# Altium project DIOT_Sampler.PrjPCB (part 1 of 5)
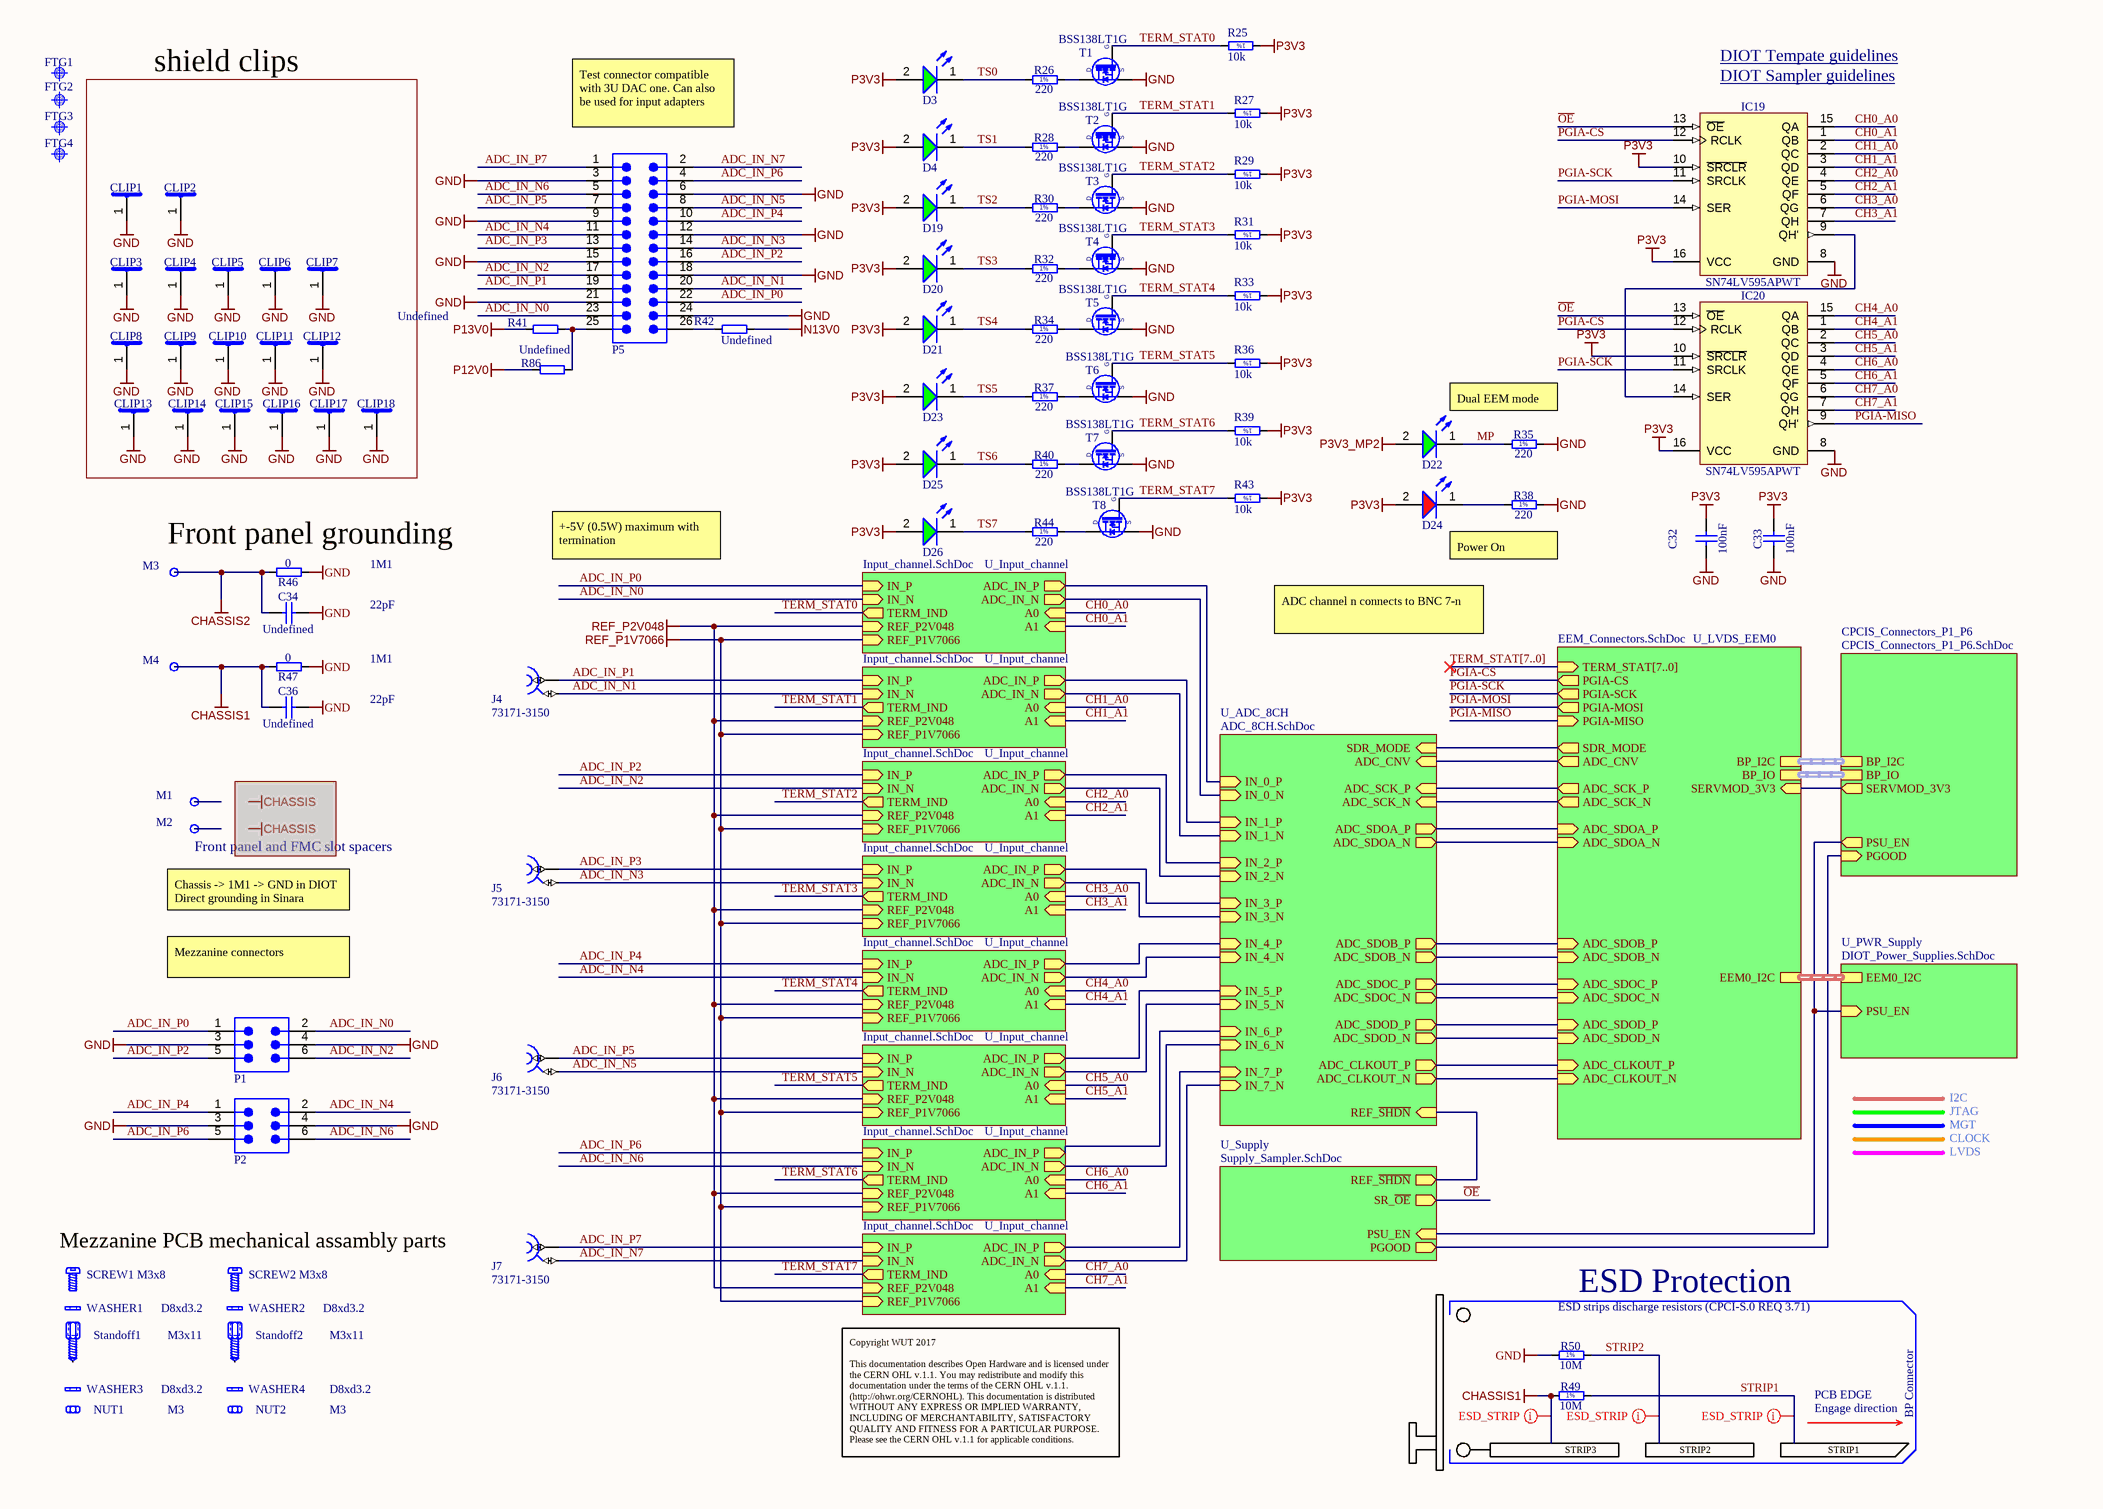
[diagram p0: Sampler.schdoc]
7 sheets, 679 parts. Net scope: hierarchical (ports join the sheet entries above them; power ports are global).
Board file: DIOT_Sampler.PCBDOC
Sheets:
  Sampler.schdoc
    U_ADC_8CH = ADC_8CH.SchDoc
    U_LVDS_EEM0 = EEM_Connectors.SchDoc
    U_Supply = Supply_Sampler.SchDoc
    U_Input_channel = Input_channel.SchDoc
    U_Input_channel = Input_channel.SchDoc
    U_Input_channel = Input_channel.SchDoc
    U_Input_channel = Input_channel.SchDoc
    U_Input_channel = Input_channel.SchDoc
    U_Input_channel = Input_channel.SchDoc
    U_Input_channel = Input_channel.SchDoc
    U_Input_channel = Input_channel.SchDoc
    U_PWR_Supply = DIOT_Power_Supplies.SchDoc
    CPCIS_Connectors_P1_P6 = CPCIS_Connectors_P1_P6.SchDoc

## Sheet Sampler.schdoc: Sampler - top
size A3; Author: G.K.; CompanyName: WUT; DrawnBy: G.K.; Organization: CERN; Address1: Warsaw Univeristy of Technology; Address2: Nowowiejska 15/19; DocumentNumber: 1; Revision: -; SheetNumber: 1; SheetTotal: 5; EDA_Number: ARTIQ; Projet: Sampler; ModifiedBy: -; CreateDate: XX/XX/XXXX; CheckedDate: -; Title2: 8 channel ADC v2.3.1; DivGrp: ISE; Designer: G.K.; SPICEModelCacheCKYBAJTW: <root> / <DocumentId>CKYBAJTW</DocumentId> / <CacheFrame Number="0"> / <Model Name="0603_155060gs75300" Kind="CKT"> / <Text>******** / .subckt 0603_155060GS75300 1 2 / D1 1 2 SMSW / .MODEL SMSW D / + IS=695.94E-6 / + N=5 / + RS=2.4677 / + IKF=16.109E-12 / + CJO=1.0000E-12 / + M=.3333 / + VJ=.75 / + BV=5 / + IBV=10.00E-6 / + TT=5.0000E-9 / .ends</Text> / </Model> / <Model Name="0603_155060rs75300" Kind="CKT"> / <Text>******** / .subckt 0603_155060RS75300 1 2 / D1 1 2 SMSW / .MODEL SMSW D / + IS=824.78E-18 / + N=2.2038 / + RS=.38595 / + IKF=240.07E-6 / + CJO=1.0000E-12 / + M=.3333 / + VJ=.75 / + BV=5 / + IBV=10.00E-6 / + TT=5.0000E-9 / .ends</Text> / </Model> / </CacheFrame> / </root>; ModifiedDate: -; ProjectName: Sampler

### Parts
(Parts that share a designator on the sheet are numbered #1, #2 ... from top to bottom, then left to right.)
C32  100nF  [CAPC1608X87N]
C33  100nF  [CAPC1608X87N]
C34  Undefined  [CAPC2012X135N]
C36  Undefined  [CAPC2012X135N]
CLIP1  S1411-46R  [CLIP_HOLLAND-SHIELDING_LC]  (value not drawn)
CLIP2  S1411-46R  [CLIP_HOLLAND-SHIELDING_LC]  (value not drawn)
CLIP3  S1411-46R  [CLIP_HOLLAND-SHIELDING_LC]  (value not drawn)
CLIP4  S1411-46R  [CLIP_HOLLAND-SHIELDING_LC]  (value not drawn)
CLIP5  S1411-46R  [CLIP_HOLLAND-SHIELDING_LC]  (value not drawn)
CLIP6  S1411-46R  [CLIP_HOLLAND-SHIELDING_LC]  (value not drawn)
CLIP7  S1411-46R  [CLIP_HOLLAND-SHIELDING_LC]  (value not drawn)
CLIP8  S1411-46R  [CLIP_HOLLAND-SHIELDING_LC]  (value not drawn)
CLIP9  S1411-46R  [CLIP_HOLLAND-SHIELDING_LC]  (value not drawn)
CLIP10  S1411-46R  [CLIP_HOLLAND-SHIELDING_LC]  (value not drawn)
CLIP11  S1411-46R  [CLIP_HOLLAND-SHIELDING_LC]  (value not drawn)
CLIP12  S1411-46R  [CLIP_HOLLAND-SHIELDING_LC]  (value not drawn)
CLIP13  S1411-46R  [CLIP_HOLLAND-SHIELDING_LC]  (value not drawn)
CLIP14  S1411-46R  [CLIP_HOLLAND-SHIELDING_LC]  (value not drawn)
CLIP15  S1411-46R  [CLIP_HOLLAND-SHIELDING_LC]  (value not drawn)
CLIP16  S1411-46R  [CLIP_HOLLAND-SHIELDING_LC]  (value not drawn)
CLIP17  S1411-46R  [CLIP_HOLLAND-SHIELDING_LC]  (value not drawn)
CLIP18  S1411-46R  [CLIP_HOLLAND-SHIELDING_LC]  (value not drawn)
D3  Green, 3.2V, 140°  [WL-SMSW_0603_L1.6W0.98H0.8]  (value not drawn)
D4  Green, 3.2V, 140°  [WL-SMSW_0603_L1.6W0.98H0.8]  (value not drawn)
D19  Green, 3.2V, 140°  [WL-SMSW_0603_L1.6W0.98H0.8]  (value not drawn)
D20  Green, 3.2V, 140°  [WL-SMSW_0603_L1.6W0.98H0.8]  (value not drawn)
D21  Green, 3.2V, 140°  [WL-SMSW_0603_L1.6W0.98H0.8]  (value not drawn)
D22  Green, 3.2V, 140°  [WL-SMSW_0603_L1.6W0.98H0.8]  (value not drawn)
D23  Green, 3.2V, 140°  [WL-SMSW_0603_L1.6W0.98H0.8]  (value not drawn)
D24  Red, 2V, 140°  [WL-SMSW_0603_L1.6W0.98H0.8]  (value not drawn)
D25  Green, 3.2V, 140°  [WL-SMSW_0603_L1.6W0.98H0.8]  (value not drawn)
D26  Green, 3.2V, 140°  [WL-SMSW_0603_L1.6W0.98H0.8]  (value not drawn)
FTG1  Use only in PCB  [FIDUCIAL_TOP_C100-200]  (value not drawn)  (no BOM)
FTG2  Use only in PCB  [FIDUCIAL_TOP_C100-200]  (value not drawn)  (no BOM)
FTG3  Use only in PCB  [FIDUCIAL_TOP_S100-200]  (value not drawn)  (no BOM)
FTG4  Use only in PCB  [FIDUCIAL_TOP_S100-200]  (value not drawn)  (no BOM)
IC19  SN74LV595APWT  [SOP65P640X120-16N]
IC20  SN74LV595APWT  [SOP65P640X120-16N]
J4  73171-3150  [MOLEX_73171-3150]
J5  73171-3150  [MOLEX_73171-3150]
J6  73171-3150  [MOLEX_73171-3150]
J7  73171-3150  [MOLEX_73171-3150]
M1  Plated Hole  [MTG300_600]  (value not drawn)  (no BOM)
M2  Plated Hole  [MTG300_600]  (value not drawn)  (no BOM)
M3  Plated Hole  [MTG300_600]  (value not drawn)  (no BOM)
M4  Plated Hole  [MTG300_600]  (value not drawn)  (no BOM)
NUT1  M3  [BOSSARD_BN81-1400401_v]
NUT2  M3  [BOSSARD_BN81-1400401_v]
P1  61300621121  [61300621121]  (value not drawn)
P2  61300621121  [61300621121]  (value not drawn)
P5  61302621121  [61302621121]  (value not drawn)
R25  10k  [RESC1005X40N]
R26  220  [RESC1608X55N]
R27  10k  [RESC1005X40N]
R28  220  [RESC1608X55N]
R29  10k  [RESC1005X40N]
R30  220  [RESC1608X55N]
R31  10k  [RESC1005X40N]
R32  220  [RESC1608X55N]
R33  10k  [RESC1005X40N]
R34  220  [RESC1608X55N]
R35  220  [RESC1608X55N]
R36  10k  [RESC1005X40N]
R37  220  [RESC1608X55N]
R38  220  [RESC1608X55N]
R39  10k  [RESC1005X40N]
R40  220  [RESC1608X55N]
R41  Undefined  [RESC1608X55N]
R42  Undefined  [RESC1608X55N]
R43  10k  [RESC1005X40N]
R44  220  [RESC1608X55N]
R46  0  [RESC1608X55N]
R47  0  [RESC1608X55N]
R49  10M  [RESC2113X55N]
R50  10M  [RESC2113X55N]
R86#1  Undefined  [RESC1608X55N]
SCREW1  M3x8  [BOSSARD_BN5687-3061606_v]
SCREW2  M3x8  [BOSSARD_BN5687-3061606_v]
Standoff1  M3x11  [SAMTEC_SO-1115-03-N]
Standoff2  M3x11  [SAMTEC_SO-1115-03-N]
T1  BSS138LT1G  [SOT95P240X110-3N]
T2  BSS138LT1G  [SOT95P240X110-3N]
T3  BSS138LT1G  [SOT95P240X110-3N]
T4  BSS138LT1G  [SOT95P240X110-3N]
T5  BSS138LT1G  [SOT95P240X110-3N]
T6  BSS138LT1G  [SOT95P240X110-3N]
T7  BSS138LT1G  [SOT95P240X110-3N]
T8  BSS138LT1G  [SOT95P240X110-3N]
WASHER1  D8xd3.2  [BOSSARD_BN678-1250191_v]
WASHER2  D8xd3.2  [BOSSARD_BN678-1250191_v]
WASHER3  D8xd3.2  [BOSSARD_BN678-1250191_v]
WASHER4  D8xd3.2  [BOSSARD_BN678-1250191_v]

### Blocks framed on the sheet
shield clips: CLIP1-CLIP18

### Sub-sheets
CPCIS_Connectors_P1_P6 = CPCIS_Connectors_P1_P6.SchDoc: BP_I2C (harness I2C), SERVMOD_3V3 (out), PSU_EN (out), BP_IO (harness EEM_LVDS), PGOOD (in)
U_ADC_8CH = ADC_8CH.SchDoc: IN_1_P (in), IN_2_P (in), IN_0_P (in), IN_3_P (in), IN_4_P (in), IN_5_P (in), IN_6_P (in), IN_7_P (in), IN_0_N (in), IN_1_N (in), IN_2_N (in), IN_3_N (in), IN_6_N (in), IN_7_N (in), IN_4_N (in), IN_5_N (in), ADC_SDOA_P (out), ADC_SDOA_N (out), ADC_SCK_P (in), ADC_SCK_N (in), ADC_CNV (in), ADC_SDOB_N (out), ADC_SDOB_P (out), ADC_SDOC_P (out), ADC_SDOC_N (out), ADC_SDOD_N (out), ADC_SDOD_P (out), ADC_CLKOUT_P (out), ADC_CLKOUT_N (out), SDR_MODE (in), REF_~{SHDN} (in)
U_Input_channel = Input_channel.SchDoc: IN_N (in), A0 (in), A1 (in), IN_P (in), TERM_IND (out), ADC_IN_N (out), ADC_IN_P (out), REF_P2V048 (in), REF_P1V7066 (in)
U_Input_channel = Input_channel.SchDoc: IN_N (in), A0 (in), A1 (in), IN_P (in), TERM_IND (out), ADC_IN_N (out), ADC_IN_P (out), REF_P2V048 (in), REF_P1V7066 (in)
U_Input_channel = Input_channel.SchDoc: IN_N (in), A0 (in), A1 (in), IN_P (in), TERM_IND (out), ADC_IN_N (out), ADC_IN_P (out), REF_P2V048 (in), REF_P1V7066 (in)
U_Input_channel = Input_channel.SchDoc: IN_N (in), A0 (in), A1 (in), IN_P (in), TERM_IND (out), ADC_IN_N (out), ADC_IN_P (out), REF_P2V048 (in), REF_P1V7066 (in)
U_Input_channel = Input_channel.SchDoc: IN_N (in), A0 (in), A1 (in), IN_P (in), TERM_IND (out), ADC_IN_N (out), ADC_IN_P (out), REF_P2V048 (in), REF_P1V7066 (in)
U_Input_channel = Input_channel.SchDoc: IN_N (in), A0 (in), A1 (in), IN_P (in), TERM_IND (out), ADC_IN_N (out), ADC_IN_P (out), REF_P2V048 (in), REF_P1V7066 (in)
U_Input_channel = Input_channel.SchDoc: IN_N (in), A0 (in), A1 (in), IN_P (in), TERM_IND (out), ADC_IN_N (out), ADC_IN_P (out), REF_P2V048 (in), REF_P1V7066 (in)
U_Input_channel = Input_channel.SchDoc: IN_N (in), A0 (in), A1 (in), IN_P (in), TERM_IND (out), ADC_IN_N (out), ADC_IN_P (out), REF_P2V048 (in), REF_P1V7066 (in)
U_LVDS_EEM0 = EEM_Connectors.SchDoc: TERM_STAT[7..0] (in), PGIA-CS (out), PGIA-SCK (out), PGIA-MOSI (out), PGIA-MISO (in), ADC_SDOA_N (in), ADC_SDOA_P (in), ADC_SCK_N (out), ADC_SCK_P (out), ADC_CNV (out), SDR_MODE (out), EEM0_I2C (harness I2C), BP_IO (harness EEM_LVDS), BP_I2C (harness I2C), SERVMOD_3V3 (in), ADC_SDOB_P (in), ADC_SDOB_N (in), ADC_SDOC_P (in), ADC_SDOC_N (in), ADC_SDOD_P (in), ADC_SDOD_N (in), ADC_CLKOUT_P (in), ADC_CLKOUT_N (in)
U_PWR_Supply = DIOT_Power_Supplies.SchDoc: EEM0_I2C (harness I2C), PSU_EN (in)
U_Supply = Supply_Sampler.SchDoc: REF_~{SHDN} (out), SR_~{OE} (out), PSU_EN (in), PGOOD (out)

### Nets
CHASSIS1: C36.1 M4.1 R47.2 R49.1
CHASSIS2: C34.1 M3.1 R46.2
GND: C32.1 C33.1 C34.2 C36.2 CLIP1.1 CLIP2.1 CLIP3.1 CLIP4.1 CLIP5.1 CLIP6.1 CLIP7.1 CLIP8.1 CLIP9.1 CLIP10.1 CLIP11.1 CLIP12.1 CLIP13.1 CLIP14.1 CLIP15.1 CLIP16.1 CLIP17.1 CLIP18.1 IC19.8(GND) IC20.8(GND) P1.3 P1.4 P2.3 P2.4 P5.3 P5.6 P5.9 P5.12 P5.15 P5.18 P5.21 P5.24 R35.2 R38.2 R46.1 R47.1 R50.1 T1.2(S) T2.2(S) T3.2(S) T4.2(S) T5.2(S) T6.2(S) T7.2(S) T8.2(S)
N13V0: R42.2
P3V3: C32.2 C33.2 D3.2(A) D4.2(A) D19.2(A) D20.2(A) D21.2(A) D23.2(A) D24.2(A) D25.2(A) D26.2(A) IC19.10(~{SRCLR}) IC19.16(VCC) IC20.10(~{SRCLR}) IC20.16(VCC) R25.1 R27.1 R29.1 R31.1 R33.1 R36.1 R39.1 R43.1
P3V3_MP2: D22.2(A)
P12V0: R86#1.2
P13V0: R41.2
REF_P1V7066: sheet U_Input_channel/REF_P1V7066, sheet U_Input_channel/REF_P1V7066, sheet U_Input_channel/REF_P1V7066, sheet U_Input_channel/REF_P1V7066, sheet U_Input_channel/REF_P1V7066, sheet U_Input_channel/REF_P1V7066, sheet U_Input_channel/REF_P1V7066, sheet U_Input_channel/REF_P1V7066
REF_P2V048: sheet U_Input_channel/REF_P2V048, sheet U_Input_channel/REF_P2V048, sheet U_Input_channel/REF_P2V048, sheet U_Input_channel/REF_P2V048, sheet U_Input_channel/REF_P2V048, sheet U_Input_channel/REF_P2V048, sheet U_Input_channel/REF_P2V048, sheet U_Input_channel/REF_P2V048
ADC_CLKOUT_N: sheet U_ADC_8CH/ADC_CLKOUT_N, sheet U_LVDS_EEM0/ADC_CLKOUT_N
ADC_CLKOUT_P: sheet U_ADC_8CH/ADC_CLKOUT_P, sheet U_LVDS_EEM0/ADC_CLKOUT_P
ADC_IN_N0: P1.2 P5.23 ; sheet U_Input_channel/IN_N
ADC_IN_N1: J4.2 P5.20 ; sheet U_Input_channel/IN_N
ADC_IN_N2: P1.6 P5.17 ; sheet U_Input_channel/IN_N
ADC_IN_N3: J5.2 P5.14 ; sheet U_Input_channel/IN_N
ADC_IN_N4: P2.2 P5.11 ; sheet U_Input_channel/IN_N
ADC_IN_N5: J6.2 P5.8 ; sheet U_Input_channel/IN_N
ADC_IN_N6: P2.6 P5.5 ; sheet U_Input_channel/IN_N
ADC_IN_N7: J7.2 P5.2 ; sheet U_Input_channel/IN_N
ADC_IN_P0: P1.1 P5.22 ; sheet U_Input_channel/IN_P
ADC_IN_P1: J4.1 P5.19 ; sheet U_Input_channel/IN_P
ADC_IN_P2: P1.5 P5.16 ; sheet U_Input_channel/IN_P
ADC_IN_P3: J5.1 P5.13 ; sheet U_Input_channel/IN_P
ADC_IN_P4: P2.1 P5.10 ; sheet U_Input_channel/IN_P
ADC_IN_P5: J6.1 P5.7 ; sheet U_Input_channel/IN_P
ADC_IN_P6: P2.5 P5.4 ; sheet U_Input_channel/IN_P
ADC_IN_P7: J7.1 P5.1 ; sheet U_Input_channel/IN_P
ADC_SCK_N: sheet U_ADC_8CH/ADC_SCK_N, sheet U_LVDS_EEM0/ADC_SCK_N
ADC_SCK_P: sheet U_ADC_8CH/ADC_SCK_P, sheet U_LVDS_EEM0/ADC_SCK_P
ADC_SDOA_N: sheet U_ADC_8CH/ADC_SDOA_N, sheet U_LVDS_EEM0/ADC_SDOA_N
ADC_SDOA_P: sheet U_ADC_8CH/ADC_SDOA_P, sheet U_LVDS_EEM0/ADC_SDOA_P
ADC_SDOB_N: sheet U_ADC_8CH/ADC_SDOB_N, sheet U_LVDS_EEM0/ADC_SDOB_N
ADC_SDOB_P: sheet U_ADC_8CH/ADC_SDOB_P, sheet U_LVDS_EEM0/ADC_SDOB_P
ADC_SDOC_N: sheet U_ADC_8CH/ADC_SDOC_N, sheet U_LVDS_EEM0/ADC_SDOC_N
ADC_SDOC_P: sheet U_ADC_8CH/ADC_SDOC_P, sheet U_LVDS_EEM0/ADC_SDOC_P
ADC_SDOD_N: sheet U_ADC_8CH/ADC_SDOD_N, sheet U_LVDS_EEM0/ADC_SDOD_N
ADC_SDOD_P: sheet U_ADC_8CH/ADC_SDOD_P, sheet U_LVDS_EEM0/ADC_SDOD_P
CH0_A0: IC19.15(QA) ; sheet U_Input_channel/A0
CH0_A1: IC19.1(QB) ; sheet U_Input_channel/A1
CH1_A0: IC19.2(QC) ; sheet U_Input_channel/A0
CH1_A1: IC19.3(QD) ; sheet U_Input_channel/A1
CH2_A0: IC19.4(QE) ; sheet U_Input_channel/A0
CH2_A1: IC19.5(QF) ; sheet U_Input_channel/A1
CH3_A0: IC19.6(QG) ; sheet U_Input_channel/A0
CH3_A1: IC19.7(QH) ; sheet U_Input_channel/A1
CH4_A0: IC20.15(QA) ; sheet U_Input_channel/A0
CH4_A1: IC20.1(QB) ; sheet U_Input_channel/A1
CH5_A0: IC20.2(QC) ; sheet U_Input_channel/A0
CH5_A1: IC20.3(QD) ; sheet U_Input_channel/A1
CH6_A0: IC20.4(QE) ; sheet U_Input_channel/A0
CH6_A1: IC20.5(QF) ; sheet U_Input_channel/A1
CH7_A0: IC20.6(QG) ; sheet U_Input_channel/A0
CH7_A1: IC20.7(QH) ; sheet U_Input_channel/A1
IN_0_N: sheet U_ADC_8CH/IN_0_N, sheet U_Input_channel/ADC_IN_N
IN_0_P: sheet U_ADC_8CH/IN_0_P, sheet U_Input_channel/ADC_IN_P
IN_1_N: sheet U_ADC_8CH/IN_1_N, sheet U_Input_channel/ADC_IN_N
IN_1_P: sheet U_ADC_8CH/IN_1_P, sheet U_Input_channel/ADC_IN_P
IN_2_N: sheet U_ADC_8CH/IN_2_N, sheet U_Input_channel/ADC_IN_N
IN_2_P: sheet U_ADC_8CH/IN_2_P, sheet U_Input_channel/ADC_IN_P
IN_3_N: sheet U_ADC_8CH/IN_3_N, sheet U_Input_channel/ADC_IN_N
IN_3_P: sheet U_ADC_8CH/IN_3_P, sheet U_Input_channel/ADC_IN_P
IN_4_N: sheet U_ADC_8CH/IN_4_N, sheet U_Input_channel/ADC_IN_N
IN_4_P: sheet U_ADC_8CH/IN_4_P, sheet U_Input_channel/ADC_IN_P
IN_5_N: sheet U_ADC_8CH/IN_5_N, sheet U_Input_channel/ADC_IN_N
IN_5_P: sheet U_ADC_8CH/IN_5_P, sheet U_Input_channel/ADC_IN_P
IN_6_N: sheet U_ADC_8CH/IN_6_N, sheet U_Input_channel/ADC_IN_N
IN_6_P: sheet U_ADC_8CH/IN_6_P, sheet U_Input_channel/ADC_IN_P
IN_7_N: sheet U_ADC_8CH/IN_7_N, sheet U_Input_channel/ADC_IN_N
IN_7_P: sheet U_ADC_8CH/IN_7_P, sheet U_Input_channel/ADC_IN_P
MP: D22.1(K) R35.1
~{OE}: IC19.13(~{OE}) IC20.13(~{OE}) ; sheet U_Supply/SR_~{OE}
PGIA-CS: IC19.12(RCLK) IC20.12(RCLK) ; sheet U_LVDS_EEM0/PGIA-CS
PGIA-MISO: IC20.9(QH') ; sheet U_LVDS_EEM0/PGIA-MISO
PGIA-MOSI: IC19.14(SER) ; sheet U_LVDS_EEM0/PGIA-MOSI
PGIA-SCK: IC19.11(SRCLK) IC20.11(SRCLK) ; sheet U_LVDS_EEM0/PGIA-SCK
PSU_EN: sheet U_Supply/PSU_EN, sheet U_PWR_Supply/PSU_EN, sheet CPCIS_Connectors_P1_P6/PSU_EN
SDR_MODE: sheet U_ADC_8CH/SDR_MODE, sheet U_LVDS_EEM0/SDR_MODE
SERVMOD_3V3: sheet U_LVDS_EEM0/SERVMOD_3V3, sheet CPCIS_Connectors_P1_P6/SERVMOD_3V3
STRIP1: R49.2
STRIP2: R50.2
TERM_STAT0: R25.2 T1.1(G) ; sheet U_Input_channel/TERM_IND
TERM_STAT1: R27.2 T2.1(G) ; sheet U_Input_channel/TERM_IND
TERM_STAT2: R29.2 T3.1(G) ; sheet U_Input_channel/TERM_IND
TERM_STAT3: R31.2 T4.1(G) ; sheet U_Input_channel/TERM_IND
TERM_STAT4: R33.2 T5.1(G) ; sheet U_Input_channel/TERM_IND
TERM_STAT5: R36.2 T6.1(G) ; sheet U_Input_channel/TERM_IND
TERM_STAT6: R39.2 T7.1(G) ; sheet U_Input_channel/TERM_IND
TERM_STAT7: R43.2 T8.1(G) ; sheet U_Input_channel/TERM_IND
TS0: D3.1(K) R26.1
TS1: D4.1(K) R28.1
TS2: D19.1(K) R30.1
TS3: D20.1(K) R32.1
TS4: D21.1(K) R34.1
TS5: D23.1(K) R37.1
TS6: D25.1(K) R40.1
TS7: D26.1(K) R44.1
NetD10_1: sheet U_ADC_8CH/REF_~{SHDN}, sheet U_Supply/REF_~{SHDN}
NetD24_1: D24.1(K) R38.1
NetIC7_5: sheet U_ADC_8CH/ADC_CNV, sheet U_LVDS_EEM0/ADC_CNV
NetIC19_9: IC19.9(QH') IC20.14(SER)
NetP5_25: P5.25 R41.1 R86#1.1
NetP5_26: P5.26 R42.1
NetR26_2: R26.2 T1.3(D)
NetR28_2: R28.2 T2.3(D)
NetR30_2: R30.2 T3.3(D)
NetR32_2: R32.2 T4.3(D)
NetR34_2: R34.2 T5.3(D)
NetR37_2: R37.2 T6.3(D)
NetR40_2: R40.2 T7.3(D)
NetR44_2: R44.2 T8.3(D)
NetR102_1: sheet U_Supply/PGOOD, sheet CPCIS_Connectors_P1_P6/PGOOD

Not connected (* = marked no-connect by the designer): M1 1; M2 1; Standoff1 1; Standoff2 1

### Buses and harness runs
bus TERM_STAT[7..0] = sheet U_LVDS_EEM0/TERM_STAT[7..0]
harness sheet CPCIS_Connectors_P1_P6/BP_I2C = sheet U_LVDS_EEM0/BP_I2C
harness sheet CPCIS_Connectors_P1_P6/BP_IO = sheet U_LVDS_EEM0/BP_IO
harness sheet U_LVDS_EEM0/EEM0_I2C = sheet U_PWR_Supply/EEM0_I2C

### Layout directives
net class ESD_STRIP: CHASSIS1, STRIP1, STRIP2

### Notes on the sheet
- DIOT Tempate guidelines <https://github.com/sinara-hw/DIOT-Template/issues/1>
- (near IC19) DIOT Sampler guidelines <https://github.com/sinara-hw/Sampler/issues/27>
- (near P5) Test connector compatible with 3U DAC one. Can also be used for input adapters
- Dual EEM mode
- Front panel grounding
- 1M1
- +-5V (0.5W) maximum with termination
- Power On
- 22pF
- ADC channel n connects to BNC 7-n
- (near M2) Front panel and FMC slot spacers
- (near M2) Chassis -> 1M1 -> GND in DIOT
  Direct grounding in Sinara
- Mezzanine connectors
- I2C
- JTAG
- MGT
- CLOCK
- LVDS
- Mezzanine PCB mechanical assambly parts
- (near R50) ESD strips discharge resistors (CPCI-S.0 REQ 3.71)
- ESD Protection
- PCB EDGE
- BP Connector
- Copyright WUT 2017
  This documentation describes Open Hardware and is licensed under the CERN OHL v.1.1. You may redistribute and modify this documentation under the terms of the CERN OHL v.1.1. (http://ohwr.org/CERNOHL). This documentation is distributed WITHOUT ANY EXPRESS OR IMPLIED WARRANTY, INCLUDING OF MERCHANTABILITY, SATISFACTORY QUALITY AND FITNESS FOR A PARTICULAR PURPOSE. Please see the CERN OHL v.1.1 for applicable conditions.
- (near R49) STRIP3
- STRIP2
- Engage direction
- STRIP1
- DWG NO:
- REV:
- THIS DOCUMENT AND THE DATA DISCLOSED HEREIN OR
- HEREWITH IS THE PROPERTY OF ALTIUM LIMITED AND MAY
- BE FREELY DISTRIBUTED IN WHOLE. NO RIGHTS ARE
- RESERVED OR EXPRESS OR IMPLIED WARANTEE GIVEN.
- REVISION
- DESCRIPTION
- DATE
- APPROVED
- ENG:
- APPROVALS
- PROJECT
- DSN:
- CHK:
- REFERENCE DOCUMENTS
- PROJECT REVISION:
- TITLE
- DOCUMENT REVISION:
- DESIGN ITEM:
- BOM:
- FAB DWG:
- PCB DWG:
- ASSY DWG:
- SCALE:
- A2
- SIZE
- CAGE CODE
- FILE NAME
- DWG NO.
- SHEET
- OF
- REV
- (in symbol R0402_10K_1%_0.0625W_100PPM) 1%
- (in symbol R0603_220R_1%_0.1W_100PPM) 1%
- (in symbol R0805_10M_1%_0.125W_100PPM_VISHAY_CRCW e3) 1%

### Library data of the parts
C32 C33 = CC0603_100NF_50V_10%_X7R: Non-polarised capacitor; Part Description: SMD Multilayer Chip Ceramic Capacitor; Manufacturer: GENERIC; Manufacturer1 Part Number: 223858615649; Voltage: 50V; TC: X7R; Tolerance: ±10%; Part Number: CC0603_100NF_50V_10%_X7R; Component Kind: Standard; Component Type: Standard; Pin Count: 2; Value: 100nF; Status: Preferred; Manufacturer Part Number: CC0603_100NF_50V_10%_X7R; Case: 0603; Mounted: Yes; Socket: No; SMD: Yes; Sense: No; Manufacturer1 Example: PHYCOMP; Manufacturer1 ComponentHeight: 0.87mm; HelpURL: \\cern.ch\dfs\Applications\Altium\Datasheets\CC0603_X7R_PHYCOMP.pdf; Author: CERN DEM JLC; CreateDate: 03.12.2007; LatestRevisionDate: 03.12.2007
C34 C36 = CC0805_NO-VALUE: Non-polarised capacitor; Part Description: Reserved Footprint For 0805(2012) Chip Ceramic Capacitor; Mounted: No; Part Number: CC0805_NO-VALUE; Component Kind: Standard; Component Type: Standard; Pin Count: 2; Value: Undefined; Status: None; Manufacturer: Undefined; Manufacturer Part Number: CC0805_NO-VALUE; Case: 0805; Socket: No; SMD: Yes; Sense: No; Manufacturer1 ComponentHeight: 1.35mm; HelpURL: Undefined; Author: CERN DEM JLC; CreateDate: 10.12.2008; LatestRevisionDate: 11.09.2013
CLIP1-CLIP18 = SHIELD_CLIP: Surface Mount Clip for PCB Screening Covers; Part Description: Surface Mount Clip for PCB Screening Covers, 1500 Serie; Manufacturer: HARWIN; PressFit: No; Table: Metal Screening Box; Part Number: S1411-46R; Component Kind: Standard; Component Type: Standard; Pin Count: 1; PackageDescription: Surface Mount Clip for PCB Screening Covers, 1500 Serie; Mounted: Yes; Socket: No; SMD: Yes; Status: None; Manufacturer Part Number: S1411-46R; ComponentHeight: 3.5mm; HelpURL: \\cern.ch\dfs\Applications\Altium\Datasheets\CLIP_HOLLAND-SHIELDING_LC.pdf; Author: CERN DEM JLC; CreateDate: 2013-06-25; LatestRevisionDate: 2013-06-25
D3 D4 D19-D23 D25 D26 = 155060GS75300: WL-SMSW Mono-color Side View Waterclear, size 0603, Green, 3.2V, 140°; Manufacturer: Wurth Elektronik; Case/Size Code: 0603; Chip Technology: InGaN; Dominant Wavelength: 525nm; Luminous Intensity: 560mcd; Peak Wavelength: 515nm; Manufacturer Part Number: 155060GS75300; Category: Signal LEDs; Match Code: WL-SMSW; ComponentLink1Description: Website Link; ComponentLink1URL: https://www.we-online.com/redexpert/article/155060GS75300?ad; ComponentLink2Description: Datasheet Link; ComponentLink2URL: https://www.we-online.com/redexpert/spec/155060GS75300?ad; Mount: Surface Mount; Operating Temperature Max: 85°C; Operating Temperature Min: -40°C; Packaging: Tape and Reel; Length: 1.6mm; Width: 0.98mm; Height: 0.8mm; Emitting Color: Green; Forward Voltage: 3.2V; Viewing Angle: 140°
D24 = 155060RS75300: WL-SMSW Mono-color Side View Waterclear, size 0603, Red, 2V, 140°; Manufacturer: Wurth Elektronik; Case/Size Code: 0603; Chip Technology: AlInGaP; Dominant Wavelength: 625nm; Luminous Intensity: 150mcd; Peak Wavelength: 630nm; Manufacturer Part Number: 155060RS75300; Category: Signal LEDs; Match Code: WL-SMSW; ComponentLink1Description: Website Link; ComponentLink1URL: https://www.we-online.com/redexpert/article/155060RS75300?ad; ComponentLink2Description: Datasheet Link; ComponentLink2URL: https://www.we-online.com/redexpert/spec/155060RS75300?ad; Mount: Surface Mount; Operating Temperature Max: 85°C; Operating Temperature Min: -40°C; Packaging: Tape and Reel; Length: 1.6mm; Width: 0.98mm; Height: 0.8mm; Emitting Color: Red; Forward Voltage: 2V; Viewing Angle: 140°
FTG1 FTG2 = FIDUCIAL_TARGET_C100-200: Fiducial Target; Part Description: Round Fiducial Target, Top Layer, 1.0mm, Top Solder 2.0mm, Keepout =2.0mm; Mounted: No; Part Number: FIDUCIAL_TARGET_C100-200; Component Type: Standard (No BOM); Pin Count: 1; Family: Fiducial; Socket: No; SMD: Yes; Sense: No; Status: None; ComponentHeight: 0mm; HelpURL: Undefined; Author: CERN DEM JLC; CreateDate: 09.02.2010; LatestRevisionDate: 04.04.2012; PackageDescription: Round Fiducial Target, Top Layer, 1.0mm, Top Solder 2.0mm, Keepout =2.0mm
FTG3 FTG4 = FIDUCIAL_TARGET_S100-200: Fiducial Target; Part Description: Square Fiducial Target, Top Layer, 1.0mm, Top Solder 2.0mm, Keepout =2.0mm; Mounted: No; Part Number: FIDUCIAL_TARGET_S100-200; Component Type: Standard (No BOM); Pin Count: 1; Family: Fiducial; Socket: No; SMD: Yes; Sense: No; Status: None; ComponentHeight: 0mm; HelpURL: Undefined; Author: CERN DEM JLC; CreateDate: 09.02.2010; LatestRevisionDate: 04.04.2012; PackageDescription: Square Fiducial Target, Top Layer, 1.0mm, Top Solder 2.0mm, Keepout =2.0mm
IC19 IC20 = SN74LV595APWT: 8-Bit Shift Register With 3-State Output Register; Manufacturer: TEXAS INSTRUMENTS; PressFit: No; Bonding: No; Part Number: SN74LV595APWT; Component Kind: Standard; Component Type: Standard; Device: SN74LV595APWT; PackageDescription: SOP, 0.65mm pitch; 16 pin, 4.40mm W X 5.00mm L X 1.20mm H body IPC Medium Density; Part Description: 8-Bit Shift Register With 3-State Output Register; Manufacturer Part Number: SN74LV595APWT; Pin Count: 16; Case: TSSOP16; Mounted: Yes; Socket: No; SMD: Yes; Sense: No; ComponentHeight: 1.2mm; Author: CERN DEM JLC; HelpURL: \\cern.ch\dfs\Applications\Altium\Datasheets\SN74LV595APWT.pdf; CreateDate: 10.05.2012; LatestRevisionDate: 10.05.2012
J4-J7 = MOLEX_73171-3150: RF Connectors / Coaxial Connectors BNC RA PCB RECPT 50 OHM; Manufacturer: MOLEX; Manufacturer Part Number: 73251-3150; PressFit: No; Part Number: 73171-3150; Component Kind: Standard; Component Type: Standard; Pin Count: 3; Family: BNC; Mounted: Yes; Socket: No; SMD: No; Sense: No; Status: None; Part Description: RF Connectors / Coaxial Connectors BNC RA PCB RECPT 50 OHM; HelpURL: https://www.molex.com/en-us/products/part-detail/731713150?display=pdf; CreateDate: 31.01.2025; LatestRevisionDate: 31.01.2025
M1-M4 = PLATED_HOLE3.0_PAD6.0: Single Terminal Socket; Part Description: Plated Through Hole: Hole Dia.=3.0mm Pad Dia.=6.0mm; Mounted: No; Table: Pads; Part Number: PLATED_HOLE3.0_PAD6.0; Component Type: Standard (No BOM); Designator: Single Terminal Socket; Library Reference: Single Terminal Socket; Pin Count: 1; Family: Plated Hole; Socket: No; SMD: No; Status: None; ComponentHeight: 0mm; Author: CERN DEM JLC; CreateDate: 26.05.2008; LatestRevisionDate: 26.05.2008; PackageDescription: Plated Through Hole: Hole Dia.=3.0mm Pad Dia.=6.0mm
NUT1 NUT2 = BOSSARD_BN81-1400401_v: Nut; Part Description: M3 Hexagon Nut ~0,8d, DIN 555, Polyamide PA 6.6; Manufacturer Part Number: BN81 Art.1400401; PressFit: No; Part Number: BOSSARD_BN81-1400401_v; Component Kind: Standard; Component Type: Mechanical; Pin Count: 0; PackageDescription: M3 Hexagon Nut ~0,8d, DIN 555, Polyamide PA 6.6; Mounted: Yes; Socket: No; SMD: No; Sense: No; Status: None; Value: M3; Manufacturer: BOSSARD; ComponentHeight: 2.4mm; HelpURL: \\cern.ch\dfs\Applications\Altium\Datasheets\BOSSARD_BN81-1400401.pdf; Author: CERN DEM JMW; CreateDate: 18.06.2015; LatestRevisionDate: 18.06.2015
P1 P2 = 61300621121: WR-PHD Pin Header, THT, Vertical, pitch 2.54mm, 2 Row, 6P; Manufacturer: Wurth Elektronik; Contact Resistance: 20mOhm; Rated Current: 3A; Working Voltage: 250V; Withstanding Voltage: 500V; Manufacturer Part Number: 61300621121; Category: Board-to-Board Connectors; Match Code: WR-PHD; ComponentLink1Description: Website Link; ComponentLink1URL: https://www.we-online.com/redexpert/article/61300621121?ad; ComponentLink2Description: Datasheet Link; ComponentLink2URL: https://www.we-online.com/redexpert/spec/61300621121?ad; Mount: Through Hole; Operating Temperature Max: 105°C; Operating Temperature Min: -40°C; Packaging: Bag; Gender: Pin Header; Number of Pins: 6; Number of Rows: 2; Orientation: Vertical; Pitch: 2.54mm
P5 = 61302621121: WR-PHD Pin Header, THT, Vertical, pitch 2.54mm, 2 Row, 26P; Manufacturer: Wurth Elektronik; Contact Resistance: 20mOhm; Rated Current: 3A; Working Voltage: 250V; Withstanding Voltage: 500V; Manufacturer Part Number: 61302621121; Category: Board-to-Board Connectors; Match Code: WR-PHD; ComponentLink1Description: Website Link; ComponentLink1URL: https://www.we-online.com/redexpert/article/61302621121?ad; ComponentLink2Description: Datasheet Link; ComponentLink2URL: https://www.we-online.com/redexpert/spec/61302621121?ad; Mount: Through Hole; Operating Temperature Max: 105°C; Operating Temperature Min: -40°C; Packaging: Bag; Gender: Pin Header; Number of Pins: 26; Number of Rows: 2; Orientation: Vertical; Pitch: 2.54mm
R25 R27 R29 R31 R33 R36 R39 R43 = R0402_10K_1%_0.0625W_100PPM: Resistor - 1%; Part Description: General Purpose Thick Film Chip Resistor; Manufacturer: GENERIC; Manufacturer1 Part Number: 232270671003L; TC: ±100ppm/°C; Part Number: R0402_10K_1%_0.0625W_100PPM; Component Kind: Standard; Component Type: Standard; Pin Count: 2; Value: 10k; Status: Not recommended; Power: 0.0625W; Tolerance: ±1%; Manufacturer Part Number: R0402_10K_1%_0.0625W_100PPM; Case: 0402; Mounted: Yes; Sense: No; Socket: No; SMD: Yes; Manufacturer1 Example: YAGEO PHYCOMP; Manufacturer1 ComponentHeight: 0.4mm; HelpURL: \\cern.ch\dfs\Applications\Altium\Datasheets\R0402_Phycomp_RC0402.pdf; Author: CERN DEM JLC; CreateDate: 03.12.2007; LatestRevisionDate: 17.10.2012
R26 R28 R30 R32 R34 R35 R37 R38 R40 R44 = R0603_220R_1%_0.1W_100PPM: Resistor - 1%; Part Description: General Purpose Thick Film Chip Resistor; Manufacturer: GENERIC; Manufacturer1 Part Number: NRC06F2200TRF; Power: 0.1W; TC: ±100ppm/°C; Part Number: R0603_220R_1%_0.1W_100PPM; Component Kind: Standard; Component Type: Standard; Pin Count: 2; Value: 220; Status: Preferred; Tolerance: ±1%; Manufacturer Part Number: R0603_220R_1%_0.1W_100PPM; Case: 0603; Mounted: Yes; Sense: No; Socket: No; SMD: Yes; Manufacturer1 Example: NIC COMPONENT; Manufacturer1 ComponentHeight: 0.55mm; HelpURL: \\cern.ch\dfs\Applications\Altium\Datasheets\R0603_NIC_NRC.pdf; Author: CERN DEM JLC; CreateDate: 03.12.2007; LatestRevisionDate: 13.03.2008
R41 R42 R86#1 = R0603_NO-VALUE: Resistor; Part Description: Reserved Footprint For a 0603 (1608) Chip Resistor; Mounted: No; Part Number: R0603_NO-VALUE; Component Kind: Standard; Component Type: Standard; Pin Count: 2; Value: Undefined; Status: None; Manufacturer: Undefined; Manufacturer Part Number: R0603_NO-VALUE; Case: 0603; Sense: No; Socket: No; SMD: Yes; Manufacturer1 Example: Undefined; Manufacturer1 Part Number: Undefined; Manufacturer1 ComponentHeight: Undefined; HelpURL: Undefined; Author: CERN DEM JLC; CreateDate: 03.12.2007; LatestRevisionDate: 13.03.2008
R46 R47 = R0603_0R_JUMPER: Resistor; Part Description: 1A (0.05R Max DC Resistance) Zero Ohm Jumper; Manufacturer: GENERIC; Manufacturer1 Part Number: NRC06Z0; PressFit: No; Part Number: R0603_0R_JUMPER; Component Kind: Standard; Component Type: Standard; Pin Count: 2; Value: 0; Status: Preferred; Manufacturer Part Number: R0603_0R_JUMPER; Case: 0603; Mounted: Yes; Sense: No; Socket: No; SMD: Yes; Manufacturer1 Example: NIC COMPONENT; Manufacturer1 ComponentHeight: 0.55mm; HelpURL: \\cern.ch\dfs\Applications\Altium\Datasheets\R0603_NIC_NRC.pdf; Author: CERN DEM JLC; CreateDate: 03.12.2007; LatestRevisionDate: 13.03.2008
R49 R50 = R0805_10M_1%_0.125W_100PPM_VISHAY_CRCW e3: Resistor - 1%; Part Description: 150V, Standard Thick Film Chip Resistor; Manufacturer: VISHAY DALE; Manufacturer Part Number: CRCW080510M0FKEA; Power: 0.125W; TC: ±100ppm/°C; PressFit: No; Part Number: R0805_10M_1%_0.125W_100PPM_VISHAY_CRCW e3; Component Kind: Standard; Component Type: Standard; Pin Count: 2; Value: 10M; Status: None; Tolerance: ±1%; Case: 0805; Mounted: Yes; Sense: No; Socket: No; SMD: Yes; ComponentHeight: 0.5mm; HelpURL: \\cern.ch\dfs\Applications\Altium\Datasheets\R0805_VISHAY_CRCW e3.pdf; Author: CERN DEM BC; CreateDate: 2019-11-12; LatestRevisionDate: 2019-11-12
SCREW1 SCREW2 = BOSSARD_BN5687-3061606_v: Screw; Part Description: M3 L=8mm Hexalobular Socket Pan Head Screw, Fully Threaded, Stainless Steel A2; Manufacturer Part Number: BN5687 Art.3061606; PressFit: No; Part Number: BOSSARD_BN5687-3061606_v; Component Kind: Standard; Component Type: Mechanical; Pin Count: 0; PackageDescription: M3 L=8mm Hexalobular Socket Pan Head Screw, Fully Threaded - Stainless Steel A2; Mounted: Yes; Socket: No; SMD: No; Sense: No; Status: None; Value: M3x8; Manufacturer: BOSSARD; ComponentHeight: 2.4mm; HelpURL: \\cern.ch\dfs\Applications\Altium\Datasheets\BOSSARD_BN5687-3061606.pdf; Author: CERN DEM JLC; CreateDate: 07.02.2013; LatestRevisionDate: 07.02.2013
Standoff1 Standoff2 = SAMTEC_SO-1115-03-02-02-N: Standoff Male-Female; Part Description: 11.15mm Length, Precision Board Stacking Standoff M3 Male/Female; Manufacturer: SAMTEC; PressFit: No; Part Number: SAMTEC_SO-1115-03-02-02-N; Component Kind: Standard; Component Type: Mechanical; Pin Count: 1; PackageDescription: 11.15mm Length, Precision Board Stacking Standoff M3 Male/Female; Mounted: Yes; Socket: No; SMD: No; Sense: No; Status: None; Value: M3x11; Manufacturer Part Number: SO-1115-03-02-02-N; ComponentHeight: 11.15mm; HelpURL: \\cern.ch\dfs\Applications\Altium\Datasheets\SAMTEC_SO-1115-03-02-02-N.pdf; Author: CERN DEM BC; CreateDate: 21.07.2020; LatestRevisionDate: 21.07.2020
T1-T8 = BSS138LT1G: N-CHANNEL MOSFET WITH DIODE; Part Description: 50V 200mA N-Channel Enhancement Mode Field-Effect Transistor; Manufacturer: ON SEMICONDUCTOR; PressFit: No; Bonding: No; Part Number: BSS138LT1G; Component Kind: Standard; Component Type: Standard; Device: BSS138LT1G; PackageDescription: SOT23 3-Leads, Pitch 0.95mm - Body 1.4x3mm, IPC Medium Density; Manufacturer Part Number: BSS138LT1G; Pin Count: 3; Case: SOT23-3; Mounted: Yes; Socket: No; SMD: Yes; Sense: No; ComponentHeight: 1.11mm; HelpURL: \\cern.ch\dfs\Applications\Altium\Datasheets\BSS138LT1G.pdf; Author: CERN DEM JLC; CreateDate: 23.03.2009; LatestRevisionDate: 23.03.2009
WASHER1-WASHER4 = BOSSARD_BN678-1250191_v: Washer; Part Description: Waved Spring Washer for M3 Screw, Stainless Steel A2 / 1.4310; Manufacturer Part Number: BN678 Art.1250191; PressFit: No; Status Comment: Replaced by BOSSARD_BN83728-8243964_v; Part Number: BOSSARD_BN678-1250191_v; Component Kind: Standard; Component Type: Mechanical; Pin Count: 0; PackageDescription: Waved Spring Washer for M3 Screw, Stainless Steel A2 / 1.4310; Mounted: Yes; Socket: No; SMD: No; Sense: No; Status: Obsolete; Value: D8xd3.2; Manufacturer: BOSSARD; ComponentHeight: 0.5mm; HelpURL: \\cern.ch\dfs\Applications\Altium\Datasheets\BOSSARD_BN678-1250191.pdf; Author: CERN DEM JLC; CreateDate: 15.01.2013; LatestRevisionDate: 11.12.2013

## Sheet ADC_8CH.SchDoc: ADC + reference
size 420 x 297 mm; Author: G.K.; CompanyName: WUT; DrawnBy: G.K.; Organization: CERN; Address1: Warsaw Univeristy of Technology; Address2: Nowowiejska 15/19; DocumentNumber: 2; Revision: -; SheetNumber: 2; SheetTotal: 5; EDA_Number: ARTIQ; Projet: Sampler; ModifiedBy: -; CreateDate: XX/XX/XXXX; CheckedDate: -; DivGrp: ISE; Designer: G.K.; ModifiedDate: -; ProjectName: Sampler
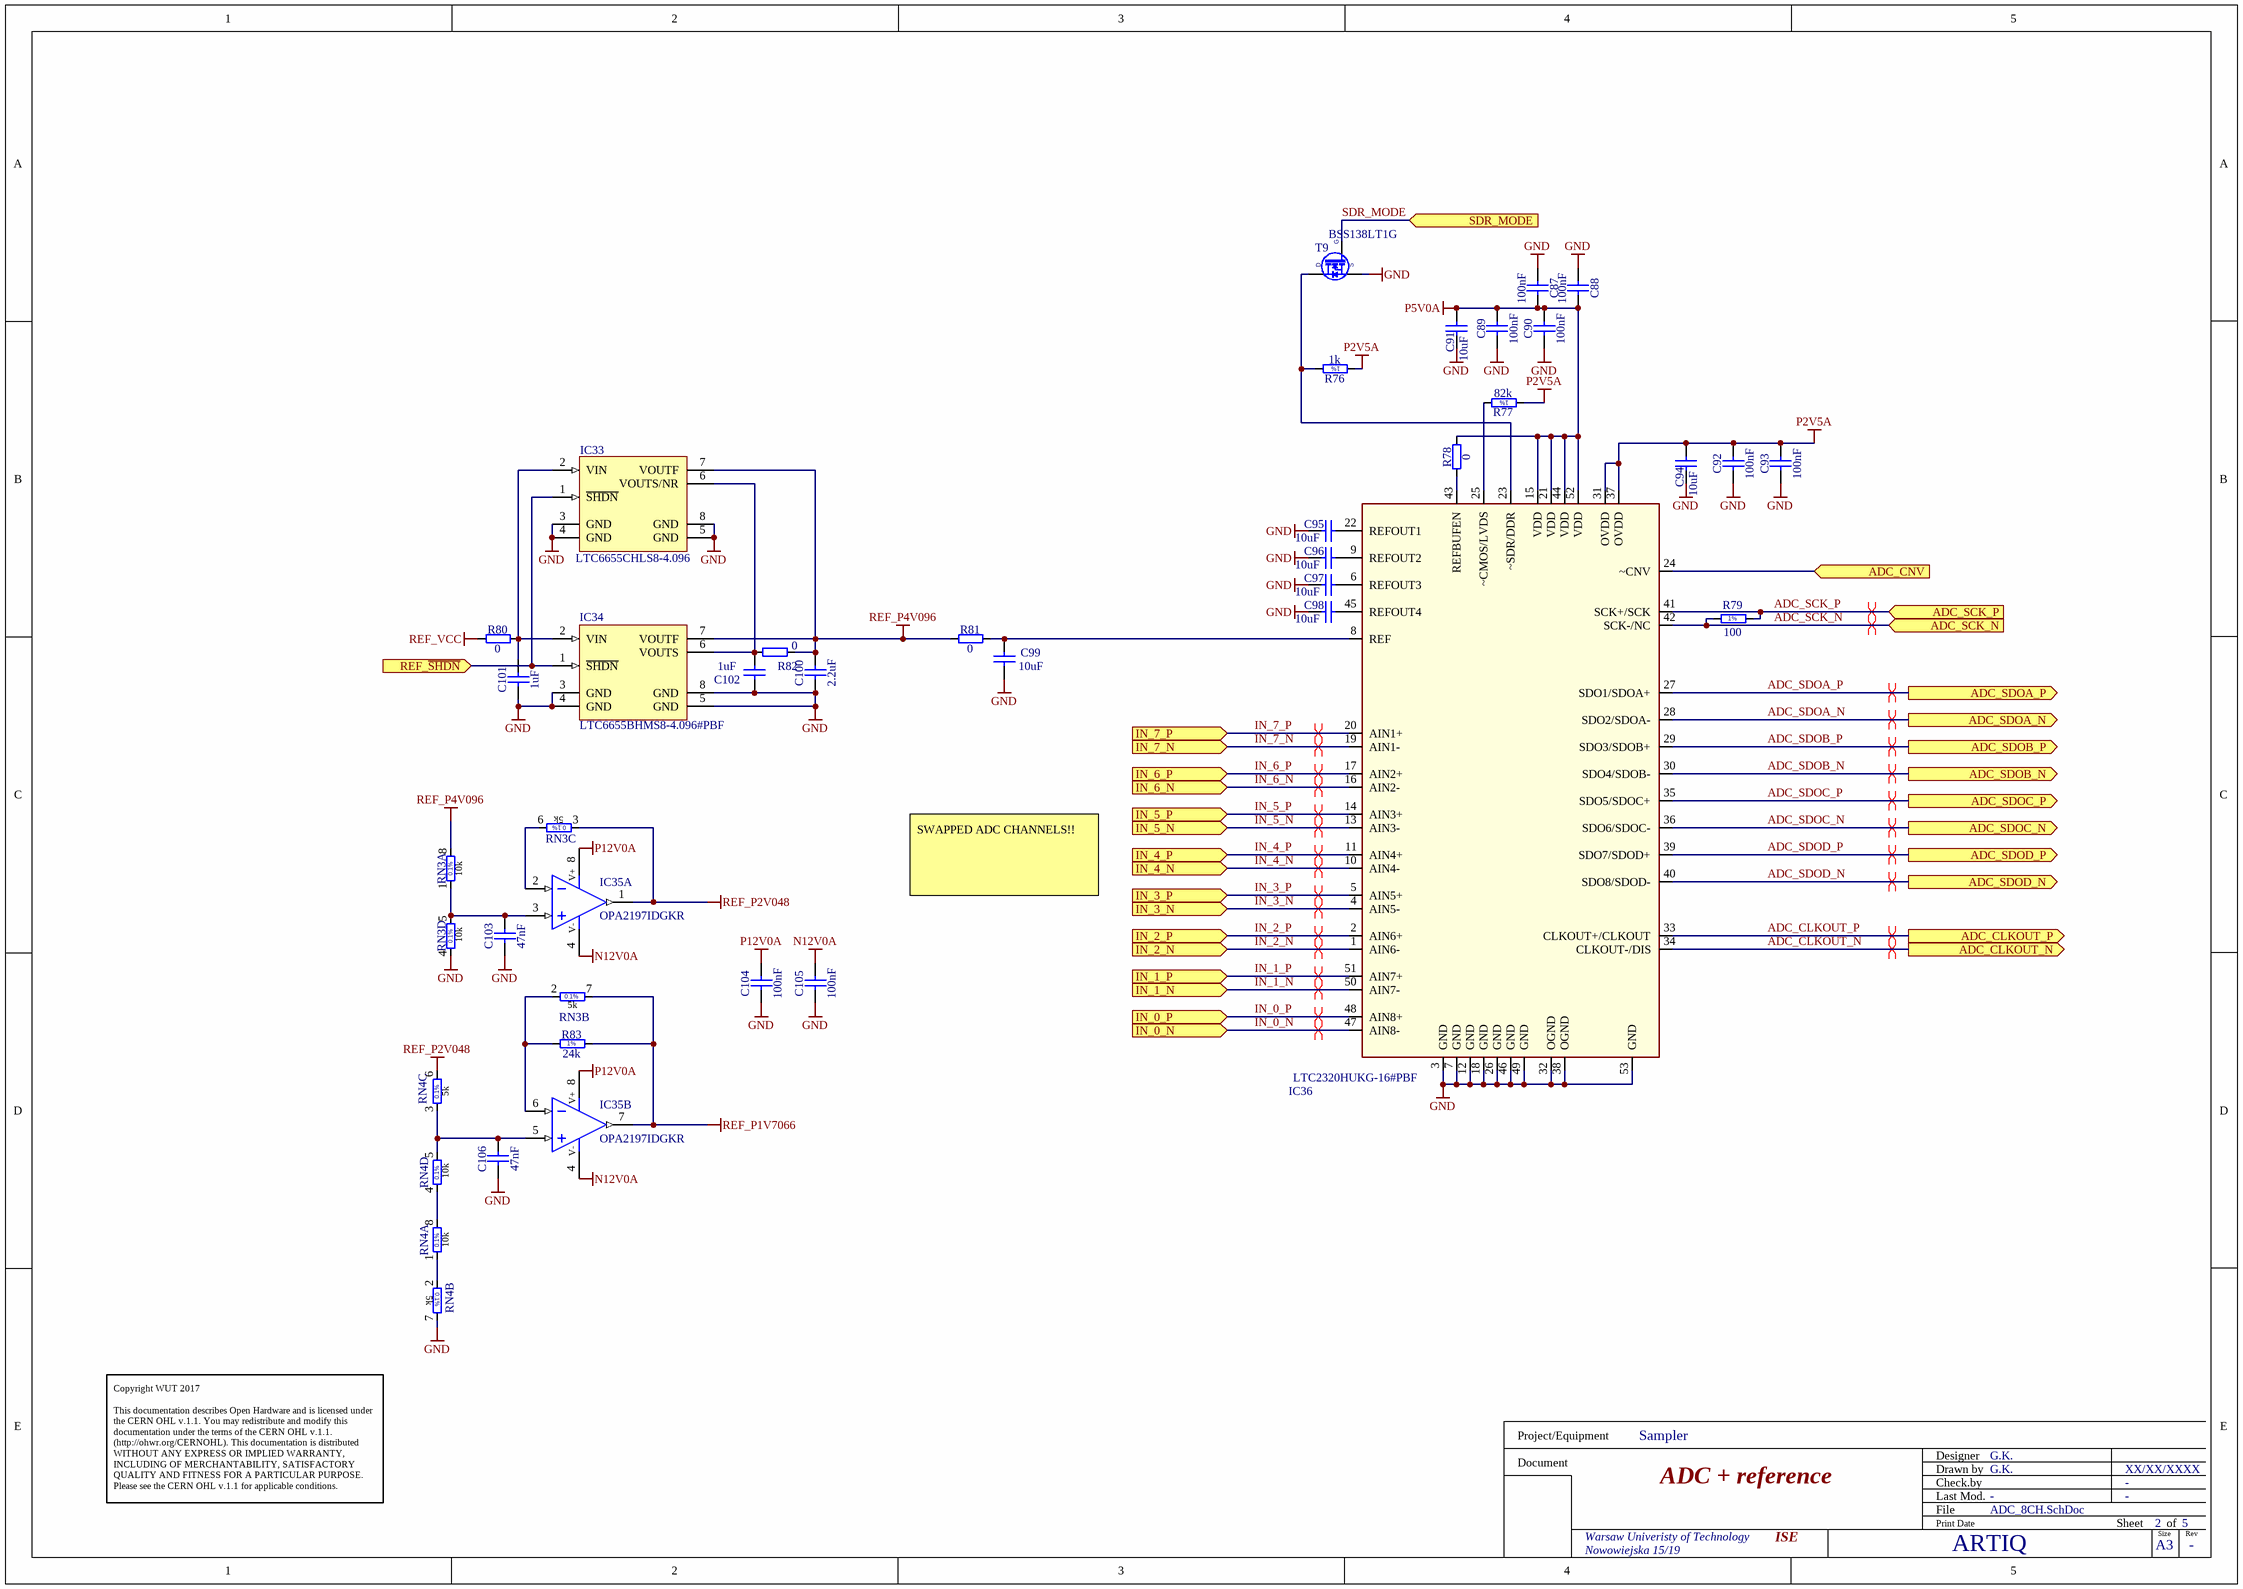
[diagram p1: ADC_8CH.SchDoc]

### Parts
C87  100nF  [CAPC1608X87N]
C88  100nF  [CAPC1608X87N]
C89  100nF  [CAPC1608X87N]
C90  100nF  [CAPC1608X87N]
C91  10uF  [CAPC2012X95N]
C92  100nF  [CAPC1608X87N]
C93  100nF  [CAPC1608X87N]
C94  10uF  [CAPC2012X95N]
C95  10uF  [CAPC2012X95N]
C96  10uF  [CAPC2012X95N]
C97  10uF  [CAPC2012X95N]
C98  10uF  [CAPC2012X95N]
C99  10uF  [CAPC2012X95N]
C100  2.2uF  [CAPC1608X87N]
C101  1uF  [CAPC1608X87N]
C102  1uF  [CAPC1608X87N]
C103  47nF  [CAPC2012X135N]
C104  100nF  [CAPC1005X55N]
C105  100nF  [CAPC1005X55N]
C106  47nF  [CAPC2012X135N]
IC33  LTC6655CHLS8-4.096  [LCCS127P500X500X145-8N]
IC34  LTC6655BHMS8-4.096#PBF  [SOP65P490X110-8N]
IC35  OPA2197IDGKR  [SOP65P490X110-8N]  (parts A,B of 2)
IC36  LTC2320HUKG-16#PBF  [QFN50P700X800X80_HS-53M]
R76  1k  [RESC1608X55N]
R77  82k  [RESC1608X55N]
R78  0  [RESC1005X40N]
R79  100  [RESC1005X40N]
R80  0  [RESC1005X40N]
R81  0  [RESC1005X40N]
R82  0  [RESC1005X40N]
R83  24k  [RESC1608X55N]
RN3  10k 5K 5K 10K  [SOIC127P600X175-8N]  (value not drawn)  (parts A,B,C,D of 4)
RN4  10k 5K 5K 10K  [SOIC127P600X175-8N]  (value not drawn)  (parts A,B,C,D of 4)
T9  BSS138LT1G  [SOT95P240X110-3N]

### Ports
ADC_CLKOUT_N (out), ADC_CLKOUT_P (out), ADC_CNV (in), ADC_SCK_N (in), ADC_SCK_P (in), ADC_SDOA_N (out), ADC_SDOA_P (out), ADC_SDOB_N (out), ADC_SDOB_P (out), ADC_SDOC_N (out), ADC_SDOC_P (out), ADC_SDOD_N (out), ADC_SDOD_P (out), IN_0_N (in), IN_0_P (in), IN_1_N (in), IN_1_P (in), IN_2_N (in), IN_2_P (in), IN_3_N (in), IN_3_P (in), IN_4_N (in), IN_4_P (in), IN_5_N (in), IN_5_P (in), IN_6_N (in), IN_6_P (in), IN_7_N (in), IN_7_P (in), REF_~{SHDN} (in), SDR_MODE (in)

### Nets
GND: C87.1 C88.1 C89.1 C90.1 C91.1 C92.1 C93.1 C94.1 C95.1 C96.1 C97.1 C98.1 C99.1 C100.1 C101.1 C102.1 C103.1 C104.1 C105.1 C106.1 IC33.3(GND) IC33.4(GND) IC33.5(GND) IC33.8(GND) IC34.3(GND) IC34.4(GND) IC34.5(GND) IC34.8(GND) IC36.3(GND) IC36.7(GND) IC36.12(GND) IC36.18(GND) IC36.26(GND) IC36.32(OGND) IC36.38(OGND) IC36.46(GND) IC36.49(GND) IC36.53(GND) RN3.4 RN4.7 T9.2(S)
N12V0A: C105.2 IC35.4(V-)
P2V5A: C92.2 C93.2 C94.2 IC36.31(OVDD) IC36.37(OVDD) R76.1 R77.1
P5V0A: C87.2 C88.2 C89.2 C90.2 C91.2 IC36.15(VDD) IC36.21(VDD) IC36.44(VDD) IC36.52(VDD) R78.2
P12V0A: C104.2 IC35.8(V+)
REF_P1V7066: IC35.7(OUT) R83.2 RN3.7
REF_P2V048: IC35.1(OUT) RN3.3 RN4.6
REF_P4V096: C100.2 IC33.7(VOUTF) IC34.7(VOUTF) R81.1 R82.2 RN3.8
REF_VCC: R80.1
ADC_CLKOUT_N: IC36.34(CLKOUT-/DIS) ; port ADC_CLKOUT_N
ADC_CLKOUT_P: IC36.33(CLKOUT+/CLKOUT) ; port ADC_CLKOUT_P
ADC_SCK_N: IC36.42(SCK-/NC) R79.1 ; port ADC_SCK_N
ADC_SCK_P: IC36.41(SCK+/SCK) R79.2 ; port ADC_SCK_P
ADC_SDOA_N: IC36.28(SDO2/SDOA-) ; port ADC_SDOA_N
ADC_SDOA_P: IC36.27(SDO1/SDOA+) ; port ADC_SDOA_P
ADC_SDOB_N: IC36.30(SDO4/SDOB-) ; port ADC_SDOB_N
ADC_SDOB_P: IC36.29(SDO3/SDOB+) ; port ADC_SDOB_P
ADC_SDOC_N: IC36.36(SDO6/SDOC-) ; port ADC_SDOC_N
ADC_SDOC_P: IC36.35(SDO5/SDOC+) ; port ADC_SDOC_P
ADC_SDOD_N: IC36.40(SDO8/SDOD-) ; port ADC_SDOD_N
ADC_SDOD_P: IC36.39(SDO7/SDOD+) ; port ADC_SDOD_P
IN_0_N: IC36.47(AIN8-) ; port IN_0_N
IN_0_P: IC36.48(AIN8+) ; port IN_0_P
IN_1_N: IC36.50(AIN7-) ; port IN_1_N
IN_1_P: IC36.51(AIN7+) ; port IN_1_P
IN_2_N: IC36.1(AIN6-) ; port IN_2_N
IN_2_P: IC36.2(AIN6+) ; port IN_2_P
IN_3_N: IC36.4(AIN5-) ; port IN_3_N
IN_3_P: IC36.5(AIN5+) ; port IN_3_P
IN_4_N: IC36.10(AIN4-) ; port IN_4_N
IN_4_P: IC36.11(AIN4+) ; port IN_4_P
IN_5_N: IC36.13(AIN3-) ; port IN_5_N
IN_5_P: IC36.14(AIN3+) ; port IN_5_P
IN_6_N: IC36.16(AIN2-) ; port IN_6_N
IN_6_P: IC36.17(AIN2+) ; port IN_6_P
IN_7_N: IC36.19(AIN1-) ; port IN_7_N
IN_7_P: IC36.20(AIN1+) ; port IN_7_P
SDR_MODE: T9.1(G) ; port SDR_MODE
NetC95_2: C95.2 IC36.22(REFOUT1)
NetC96_2: C96.2 IC36.9(REFOUT2)
NetC97_2: C97.2 IC36.6(REFOUT3)
NetC98_2: C98.2 IC36.45(REFOUT4)
NetC99_2: C99.2 IC36.8(REF) R81.2
NetC101_2: C101.2 IC33.2(VIN) IC34.2(VIN) R80.2
NetC102_2: C102.2 IC33.6(VOUTS/NR) IC34.6(VOUTS) R82.1
NetC103_2: C103.2 IC35.3(IN+) RN3.1 RN3.5
NetC106_2: C106.2 IC35.5(IN+) RN4.3 RN4.5
NetD10_1: IC33.1(~{SHDN}) IC34.1(~{SHDN}) ; port REF_~{SHDN}
NetIC7_5: IC36.24(~CNV) ; port ADC_CNV
NetIC35_2: IC35.2(IN-) RN3.6
NetIC35_6: IC35.6(IN-) R83.1 RN3.2
NetIC36_23: IC36.23(~SDR/DDR) R76.2 T9.3(D)
NetIC36_25: IC36.25(~CMOS/LVDS) R77.2
NetIC36_43: IC36.43(REFBUFEN) R78.1
NetRN4_1: RN4.1 RN4.2
NetRN4_4: RN4.4 RN4.8

### Layout directives
differential pair: ADC_CLKOUT_N, ADC_CLKOUT_P, ADC_SCK_N, ADC_SCK_P, ADC_SDOA_N, ADC_SDOA_P, ADC_SDOB_N, ADC_SDOB_P, ADC_SDOC_N, ADC_SDOC_P, ADC_SDOD_N, ADC_SDOD_P, IN_0_N, IN_0_P, IN_1_N, IN_1_P, IN_2_N, IN_2_P, IN_3_N, IN_3_P, IN_4_N, IN_4_P, IN_5_N, IN_5_P, IN_6_N, IN_6_P, IN_7_N, IN_7_P

### Notes on the sheet
- SWAPPED ADC CHANNELS!!
- Copyright WUT 2017
  This documentation describes Open Hardware and is licensed under the CERN OHL v.1.1. You may redistribute and modify this documentation under the terms of the CERN OHL v.1.1. (http://ohwr.org/CERNOHL). This documentation is distributed WITHOUT ANY EXPRESS OR IMPLIED WARRANTY, INCLUDING OF MERCHANTABILITY, SATISFACTORY QUALITY AND FITNESS FOR A PARTICULAR PURPOSE. Please see the CERN OHL v.1.1 for applicable conditions.
- Project/Equipment
- Document
- Designer
- Drawn by
- Check.by
- File
- Last Mod.
- Print Date
- Sheet
- Size
- A3
- of
- Rev
- (in symbol R0402_100R_1%_0.1W_100PPM) 1%
- (in symbol R0603_1K_1%_0.1W_100PPM) 1%
- (in symbol R0603_24K_1%_0.1W_100PPM) 1%
- (in symbol R0603_82K_1%_0.1W_100PPM) 1%
- (in symbol RN_10K_5K_VISHAY_AORN2-1AT3, part A) 10k
- (in symbol RN_10K_5K_VISHAY_AORN2-1AT3, part B) 5k
- (in symbol RN_10K_5K_VISHAY_AORN2-1AT3, part C) 5k
- (in symbol RN_10K_5K_VISHAY_AORN2-1AT3, part D) 10k

### Library data of the parts
C87-C90 C92 C93 = CC0603_100NF_50V_10%_X7R: as C32 on sheet Sampler; Part Number: CC0603_100NF_50V_10%_X7R; Component Kind: Standard; Component Type: Standard; Pin Count: 2; Value: 100nF; Status: Preferred; Manufacturer Part Number: CC0603_100NF_50V_10%_X7R; Case: 0603; Mounted: Yes; Socket: No; SMD: Yes; Sense: No; Manufacturer1 Example: PHYCOMP; Manufacturer1 ComponentHeight: 0.87mm; HelpURL: \\cern.ch\dfs\Applications\Altium\Datasheets\CC0603_X7R_PHYCOMP.pdf; Author: CERN DEM JLC; CreateDate: 03.12.2007; LatestRevisionDate: 03.12.2007
C91 C94-C99 = CC0805_10UF_25V_10%_X5R: Non-polarised capacitor; Part Description: SMD Multilayer Chip Ceramic Capacitor; Manufacturer: GENERIC; Manufacturer1 Part Number: GRM219R61E106KA12D; Voltage: 25V; TC: X5R; Tolerance: ±10%; Part Number: CC0805_10UF_25V_10%_X5R; Component Kind: Standard; Component Type: Standard; Pin Count: 2; Value: 10uF; Status: Preferred; Manufacturer Part Number: CC0805_10UF_25V_10%_X5R; Case: 0805; Mounted: Yes; Socket: No; SMD: Yes; Sense: No; Manufacturer1 Example: MURATA; Manufacturer1 ComponentHeight: 0.95mm; HelpURL: \\cern.ch\dfs\Applications\Altium\Datasheets\CC0805_X5R_MURATA_GRM.pdf; Author: CERN DEM JLC; CreateDate: 25.10.2012; LatestRevisionDate: 06.09.2016
C100 = CC0603_2.2UF_16V_10%_X5R: Non-polarised capacitor; Part Description: SMD Multilayer Chip Ceramic Capacitor; Manufacturer: GENERIC; Manufacturer1 Part Number: CC0603KRX5R7BB225; Voltage: 16V; TC: X5R; Tolerance: ±10%; Part Number: CC0603_2.2UF_16V_10%_X5R; Component Kind: Standard; Component Type: Standard; Pin Count: 2; Value: 2.2uF; Status: Preferred; Manufacturer Part Number: CC0603_2.2UF_16V_10%_X5R; Case: 0603; Mounted: Yes; Socket: No; SMD: Yes; Sense: No; Manufacturer1 Example: YAGEO; Manufacturer1 ComponentHeight: 0.9mm; HelpURL: \\cern.ch\dfs\Applications\Altium\Datasheets\CC0805_X5R_PHYCOMP_HC.pdf; Author: CERN DEM JLC; CreateDate: 28.04.2011; LatestRevisionDate: 28.04.2011
C101 C102 = CC0603_1UF_25V_10%_X7R: Non-polarised capacitor; Part Description: SMD Multilayer Chip Ceramic Capacitor; Manufacturer: GENERIC; Manufacturer1 Part Number: GRM188R71E105KA12D; Voltage: 25V; TC: X7R; Tolerance: ±10%; Part Number: CC0603_1UF_25V_10%_X7R; Component Kind: Standard; Component Type: Standard; Pin Count: 2; Value: 1uF; Status: None; Manufacturer Part Number: CC0603_1UF_25V_10%_X7R; Case: 0603; Mounted: Yes; Socket: No; SMD: Yes; Sense: No; Manufacturer1 Example: MURATA; Manufacturer1 ComponentHeight: 0.9mm; HelpURL: \\cern.ch\dfs\Applications\Altium\Datasheets\CC0603_X7R_MURATA.pdf; Author: CERN DEM JLC; CreateDate: 18.01.2011; LatestRevisionDate: 18.01.2011
C103 C106 = CC0805_47NF_25V_5%_C0G: Non-polarised capacitor; Part Description: SMD Multilayer Chip Ceramic Capacitor; Manufacturer: GENERIC; Manufacturer1 Part Number: C0805C473J3GACTU; Voltage: 25V; TC: C0G/NP0; Tolerance: ±5%; Part Number: CC0805_47NF_25V_5%_C0G; Component Kind: Standard; Component Type: Standard; Pin Count: 2; Value: 47nF; Status: None; Manufacturer Part Number: CC0805_47NF_25V_5%_C0G; Case: 0805; Mounted: Yes; Socket: No; SMD: Yes; Sense: No; Manufacturer1 Example: KEMET; Manufacturer1 ComponentHeight: 1.4mm; HelpURL: \\cern.ch\dfs\Applications\Altium\Datasheets\CC0805_C0G_KEMET_(Commercial Grade).pdf; Author: CERN DEM JLC; CreateDate: 18.01.2011; LatestRevisionDate: 18.01.2011
C104 C105 = CC0402_100NF_16V_10%_X5R: Non-polarised capacitor; Part Description: SMD Multilayer Chip Ceramic Capacitor; Manufacturer: GENERIC; Manufacturer1 Part Number: GRM155R61C104KA88D; Voltage: 16V; TC: X5R; Tolerance: ±10%; Part Number: CC0402_100NF_16V_10%_X5R; Component Kind: Standard; Component Type: Standard; Pin Count: 2; Value: 100nF; Status: None; Manufacturer Part Number: CC0402_100NF_16V_10%_X5R; Case: 0402; Mounted: Yes; Socket: No; SMD: Yes; Sense: No; Manufacturer1 Example: MURATA; Manufacturer1 ComponentHeight: 0.55mm; HelpURL: \\cern.ch\dfs\Applications\Altium\Datasheets\CC0402_X5R_MURATA_GRM.pdf; Author: CERN DEM JLC; CreateDate: 10.12.2013; LatestRevisionDate: 10.12.2013
IC33 = REF_LTC6655CHLS8-4.096: 4.096, 1uA Precision Voltage Reference; Part Number: LTC6655CHLS8-4.096#PBF; Part Description: 4.096V, 0.05%, 10ppm/°C, 1uA Precision Voltage Reference; Manufacturer: LINEAR TECHNOLOGY; PressFit: No; Bonding: No; Component Kind: Standard; Component Type: Standard; Device: LTC6655CHLS8-4.096; Footprint: SOT95P280X100-6N; PackageDescription: LCC, 8-Pins, Body 5,00x5,00mmx1,45mm, Pitch 1,27mm, IPC Medium Density; Manufacturer Part Number: LTC6655CHLS8-4.096#PBF; Pin Count: 8; Case: 8-CLCC; Mounted: Yes; Socket: No; SMD: Yes; Sense: No; ComponentHeight: 1mm; HelpURL: \\cern.ch\dfs\Applications\Altium\Datasheets\LT6656ACS6-3.3#TRMPBF.pdf; Author: GK; CreateDate: 2011-10-10; LatestRevisionDate: 2011-10-10
IC34 = REF_LTC6655: 0.25ppm Noise, Low Drift Precision Buffered Voltage Reference; Part Description: 4.096V, 0.25ppm Noise, Low Drift Precision Buffered Voltage Reference; Manufacturer: LINEAR TECHNOLOGY; PressFit: No; Bonding: No; Part Number: LTC6655BHMS8-4.096#PBF; Component Kind: Standard; Component Type: Standard; Device: LTC6655BHMS8-4.096#PBF; PackageDescription: SOP, 8-Leads, Body 3.1x3.1mm (max), Pitch 0.65mm, IPC Medium Density; Manufacturer Part Number: LTC6655BHMS8-4.096#PBF; Pin Count: 8; Case: SSOP8; Mounted: Yes; Socket: No; SMD: Yes; Sense: No; ComponentHeight: 1.1mm; HelpURL: \\cern.ch\dfs\Applications\Altium\Datasheets\LTC6655BHMS8-5#PBF.pdf; Author: GK; CreateDate: 07.06.2012; LatestRevisionDate: 07.06.2012
IC35 = OA_OPA2197IDGKR: 36-V, Precision, Rail-to-Rail Input Output, Low Offset Voltage Op Amp 8-VSSOP; Part Description: High-Precision, Low-Noise, Rail-to-Rail Output,10-MHz Op Amp; Manufacturer: TEXAS INSTRUMENTS; PressFit: No; Bonding: No; Part Number: OPA2197IDGKR; Component Kind: Standard; Component Type: Standard; Device: OPA2197IDGKR; PackageDescription: SOP, 0.65mm pitch; 8 pin, 3.00mm W X 3.00mm L X 1.10mm H body, IPC Medium Density; Manufacturer Part Number: OPA2197IDGKR; Pin Count: 8; Case: MSOP8; Mounted: Yes; Socket: No; SMD: Yes; Sense: No; ComponentHeight: 1.1mm; Author: GK; HelpURL: \\cern.ch\dfs\Applications\Altium\Datasheets\OPA2140AIDGK.pdf; CreateDate: 20.04.2017; LatestRevisionDate: 20.04.2017
IC36 = ADC_LTC2320HUKG-16: Octal, 16-Bit, 1.5Msps/Ch  Simultaneous Sampling ADC; Manufacturer: LINEAR TECHNOLOGY; PressFit: No; Bonding: No; Part Number: LTC2320HUKG-16#PBF; Component Kind: Standard; Component Type: Standard; Device: LTC2320HUKG-16#PBF; PackageDescription: QFN, 52-Leads, Body 7.00x8.00mm, Pitch 0.50mm, Thermal Pad 5.41x6.40mm, IPC Low Density; Part Description: Octal, 16-Bit, 1.5Msps/Ch  Simultaneous Sampling ADC; Manufacturer Part Number: LTC2320HUKG-16#PBF; Pin Count: 48; Case: QFP48; Mounted: Yes; Socket: No; SMD: Yes; Sense: No; ComponentHeight: 0.8; Author: GK; HelpURL: \\cern.ch\dfs\Applications\Altium\Datasheets\LTC2335CLX-18#PBF.pdf; CreateDate: 10.01.2017; LatestRevisionDate: 10.01.2017
R76 = R0603_1K_1%_0.1W_100PPM: Resistor - 1%; Part Description: General Purpose Thick Film Chip Resistor; Manufacturer: GENERIC; Manufacturer1 Part Number: NRC06F1001TRF; Power: 0.1W; TC: ±100ppm/°C; Part Number: R0603_1K_1%_0.1W_100PPM; Component Kind: Standard; Component Type: Standard; Pin Count: 2; Value: 1k; Status: Preferred; Tolerance: ±1%; Manufacturer Part Number: R0603_1K_1%_0.1W_100PPM; Case: 0603; Mounted: Yes; Sense: No; Socket: No; SMD: Yes; Manufacturer1 Example: NIC COMPONENT; Manufacturer1 ComponentHeight: 0.55mm; HelpURL: \\cern.ch\dfs\Applications\Altium\Datasheets\R0603_NIC_NRC.pdf; Author: CERN DEM JLC; CreateDate: 03.12.2007; LatestRevisionDate: 13.03.2008
R77 = R0603_82K_1%_0.1W_100PPM: Resistor - 1%; Part Description: General Purpose Thick Film Chip Resistor; Manufacturer: GENERIC; Manufacturer1 Part Number: NRC06F8202TRF; Power: 0.1W; TC: ±100ppm/°C; Part Number: R0603_82K_1%_0.1W_100PPM; Component Kind: Standard; Component Type: Standard; Pin Count: 2; Value: 82k; Status: Preferred; Tolerance: ±1%; Manufacturer Part Number: R0603_82K_1%_0.1W_100PPM; Case: 0603; Mounted: Yes; Sense: No; Socket: No; SMD: Yes; Manufacturer1 Example: NIC COMPONENT; Manufacturer1 ComponentHeight: 0.55mm; HelpURL: \\cern.ch\dfs\Applications\Altium\Datasheets\R0603_NIC_NRC.pdf; Author: CERN DEM JLC; CreateDate: 03.12.2007; LatestRevisionDate: 13.03.2008
R78 R80-R82 = R0402_0R_JUMPER: Resistor; Part Description: 1A (0.05R Max DC Resistance) Zero Ohm Jumper; Manufacturer: GENERIC; Manufacturer1 Part Number: 232270591001L; Part Number: R0402_0R_JUMPER; Component Kind: Standard; Component Type: Standard; Pin Count: 2; Value: 0; Status: Not recommended; Manufacturer Part Number: R0402_0R_JUMPER; Case: 0402; Mounted: Yes; Sense: No; Socket: No; SMD: Yes; Manufacturer1 Example: YAGEO PHYCOMP; Manufacturer1 ComponentHeight: 0.4mm; HelpURL: \\cern.ch\dfs\Applications\Altium\Datasheets\R0402_Phycomp_RC0402.pdf; Author: CERN DEM JLC; CreateDate: 03.12.2007; LatestRevisionDate: 17.10.2012
R79 = R0402_100R_1%_0.1W_100PPM: Resistor - 1%; Part Description: General Purpose Thick Film Chip Resistor; Manufacturer: GENERIC; Manufacturer Part Number: R0402_100R_1%_0.1W_100PPM_50V; Manufacturer1 Part Number: ERJ2RKF1000X; Power: 0.1W; TC: ±100ppm/°C; Voltage: 50V; Part Number: R0402_100R_1%_0.1W_100PPM; Component Kind: Standard; Component Type: Standard; Pin Count: 2; Value: 100; Status: Not recommended; Tolerance: ±1%; Case: 0402; Mounted: Yes; Sense: No; Socket: No; SMD: Yes; Manufacturer1 Example: PANASONIC; Manufacturer1 ComponentHeight: 0.4mm; HelpURL: \\cern.ch\dfs\Applications\Altium\Datasheets\R0402_PANASONIC_ERJ2RK.pdf; Author: CERN DEM JLC; CreateDate: 12.12.2013; LatestRevisionDate: 03.03.2015
R83 = R0603_24K_1%_0.1W_100PPM: Resistor - 1%; Part Description: General Purpose Thick Film Chip Resistor; Manufacturer: GENERIC; Manufacturer1 Part Number: NRC06F2402TRF; Power: 0.1W; TC: ±100ppm/°C; PressFit: No; Part Number: R0603_24K_1%_0.1W_100PPM; Component Kind: Standard; Component Type: Standard; Pin Count: 2; Value: 24k; Status: Preferred; Tolerance: ±1%; Manufacturer Part Number: R0603_24K_1%_0.1W_100PPM; Case: 0603; Mounted: Yes; Sense: No; Socket: No; SMD: Yes; Manufacturer1 Example: NIC COMPONENT; Manufacturer1 ComponentHeight: 0.55mm; HelpURL: \\cern.ch\dfs\Applications\Altium\Datasheets\R0603_NIC_NRC.pdf; Author: CERN DEM JLC; CreateDate: 03.12.2007; LatestRevisionDate: 13.03.2008
RN3 RN4 = RN_10K_5K_VISHAY_AORN2-1AT3: DIL8 Resistor Network 4 Resistors 10k-5k-5k-10k 0.1%; Part Description: Dual-In-Line Thin Film Precision Automotive Resistors Network, (4 Isolated) - AORN Series; Manufacturer: VISHAY DALE; Power: 4x0.1W; TC: ±25ppm/°C; PressFit: No; Part Number: RN_10K_5K_VISHAY_AORN2-1AT3; Component Kind: Standard; Component Type: Standard; Pin Count: 8; Value: 10k 5K 5K 10K; Sense: No; Tolerance: 0.1%; Manufacturer Part Number: AORN2-1AT3; Case: SOIC8; Mounted: Yes; Socket: No; SMD: Yes; ComponentHeight: 1.73mm; HelpURL: \\cern.ch\dfs\Applications\Altium\Datasheets\RN_VISHAY_AORN.pdf; Author: CERN DEM JLC; CreateDate: 20.02.2017; LatestRevisionDate: 20.02.2017
T9 = BSS138LT1G: as T1 on sheet Sampler; Part Number: BSS138LT1G; Component Kind: Standard; Component Type: Standard; Device: BSS138LT1G; PackageDescription: SOT23 3-Leads, Pitch 0.95mm - Body 1.4x3mm, IPC Medium Density; Manufacturer Part Number: BSS138LT1G; Pin Count: 3; Case: SOT23-3; Mounted: Yes; Socket: No; SMD: Yes; Sense: No; ComponentHeight: 1.11mm; HelpURL: \\cern.ch\dfs\Applications\Altium\Datasheets\BSS138LT1G.pdf; Author: CERN DEM JLC; CreateDate: 23.03.2009; LatestRevisionDate: 23.03.2009